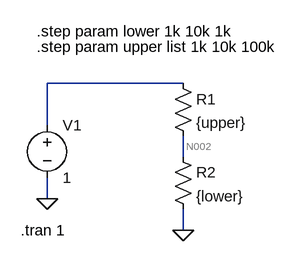
[diagram p0: schematic Draft6.asc]
Draft6.asc, the LTspice schematic file:
Version 4
SHEET 1 880 680
WIRE 240 80 32 80
WIRE 32 144 32 80
WIRE 240 192 240 160
WIRE 32 256 32 224
WIRE 240 304 240 272
FLAG 32 256 0
FLAG 240 304 0
SYMBOL voltage 32 128 R0
WINDOW 123 0 0 Left 0
WINDOW 39 0 0 Left 0
SYMATTR InstName V1
SYMATTR Value 1
SYMBOL res 224 64 R0
SYMATTR InstName R1
SYMATTR Value {upper}
SYMBOL res 224 176 R0
SYMATTR InstName R2
SYMATTR Value {lower}
TEXT 16 24 Left 2 !.step param upper list 1k 10k 100k
TEXT 16 0 Left 2 !.step param lower 1k 10k 1k
TEXT -8 304 Left 2 !.tran 1

The netlist it stands for:
* Draft6.asc
V1 N001 0 1
R1 N001 N002 {upper}
R2 N002 0 {lower}
.step param upper list 1k 10k 100k
.step param lower 1k 10k 1k
.tran 1
.backanno
.end

* Results of the author's LTspice run, read from the files saved beside the schematic
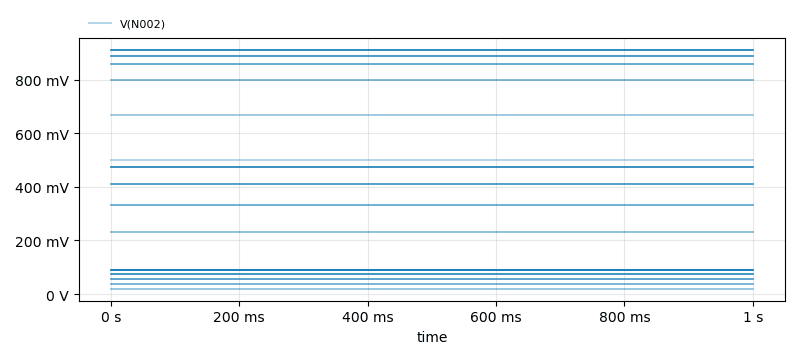
[diagram p1: Transient Analysis of Draft6.asc, plotted from the saved traces]
* Transient Analysis, 30 runs:
*   V(N002) [run 1]: min 500 mV, max 500 mV, average 500 mV, rms 500 mV, last 500 mV
*   V(N002) [run 2]: min 90.91 mV, max 90.91 mV, average 90.91 mV, rms 90.91 mV, last 90.91 mV
*   V(N002) [run 3]: min 666.7 mV, max 666.7 mV, average 666.7 mV, rms 666.7 mV, last 666.7 mV
*   V(N002) [run 4]: min 19.61 mV, max 19.61 mV, average 19.61 mV, rms 19.61 mV, last 19.61 mV
*   V(N002) [run 5]: min 230.8 mV, max 230.8 mV, average 230.8 mV, rms 230.8 mV, last 230.8 mV
*   V(N002) [run 6]: min 800 mV, max 800 mV, average 800 mV, rms 800 mV, last 800 mV
*   V(N002) [run 7]: min 38.46 mV, max 38.46 mV, average 38.46 mV, rms 38.46 mV, last 38.46 mV
*   V(N002) [run 8]: min 333.3 mV, max 333.3 mV, average 333.3 mV, rms 333.3 mV, last 333.3 mV